# Altium project Tesis.PrjPcb
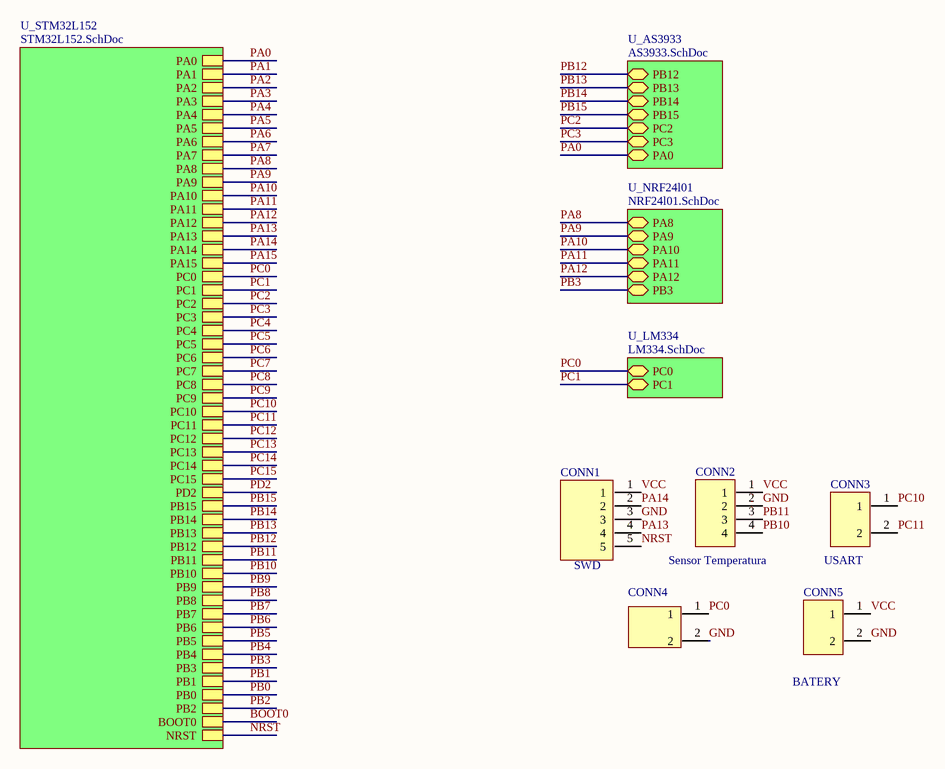
[diagram p0: Top Sheet.SchDoc]
5 sheets, 30 parts. Net scope: global (net labels, ports and power ports of the same name join across sheets).
Board files: PCB_Tesis.PcbDoc, PCB_Tesis2.PcbDoc
Sheets:
  Top Sheet.SchDoc
    U_AS3933 = AS3933.SchDoc
    U_NRF24l01 = NRF24l01.SchDoc
    U_STM32L152 = STM32L152.SchDoc
    U_LM334 = LM334.SchDoc

## Sheet Top Sheet.SchDoc
size A

### Parts
CONN1  SWD  [1x5x2.54 Pin Header TH V]
CONN2  Sensor Temperatura  [1x4x2.54 Pin Header TH V]
CONN3  USART  [1x2x2.54 Pin Header TH V]
CONN4  Connector  [1x2x2.54 Pin Header TH V - duplicate]  (value not drawn)
CONN5  BATERY  [1x2X2.54 Horizontal]

### Sub-sheets
U_AS3933 = AS3933.SchDoc: PA0, PC3, PB15, PB14, PC2, PB13, PB12
U_LM334 = LM334.SchDoc: PC1, PC0
U_NRF24l01 = NRF24l01.SchDoc: PB3, PA8, PA9, PA10, PA11, PA12
U_STM32L152 = STM32L152.SchDoc: PA0, PA1, PA2, PA3, PA4, PA5, PA6, PA7, PA8, PA9, PA10, PA11, PA12, PA13, PA14, PA15, PC0, PC1, PC2, PC3, PC4, PC5, PC6, PC7, PC8, PC9, PC10, PC11, PC12, PC13, PC14, PC15, PD2, PB15, PB14, PB13, PB12, PB11, PB10, PB9, PB8, PB7, PB6, PB5, PB4, PB3, PB1, PB0, PB2, BOOT0, NRST

### Nets
GND: CONN1.3 CONN2.2 CONN4.2 CONN5.2
VCC: CONN1.1 CONN2.1 CONN5.1
NRST: CONN1.5 ; sheet U_STM32L152/NRST
PA0: sheet U_AS3933/PA0, sheet U_STM32L152/PA0
PA8: sheet U_NRF24l01/PA8, sheet U_STM32L152/PA8
PA9: sheet U_NRF24l01/PA9, sheet U_STM32L152/PA9
PA10: sheet U_NRF24l01/PA10, sheet U_STM32L152/PA10
PA11: sheet U_NRF24l01/PA11, sheet U_STM32L152/PA11
PA12: sheet U_NRF24l01/PA12, sheet U_STM32L152/PA12
PA13: CONN1.4 ; sheet U_STM32L152/PA13
PA14: CONN1.2 ; sheet U_STM32L152/PA14
PB3: sheet U_NRF24l01/PB3, sheet U_STM32L152/PB3
PB10: CONN2.4 ; sheet U_STM32L152/PB10
PB11: CONN2.3 ; sheet U_STM32L152/PB11
PB12: sheet U_AS3933/PB12, sheet U_STM32L152/PB12
PB13: sheet U_AS3933/PB13, sheet U_STM32L152/PB13
PB14: sheet U_AS3933/PB14, sheet U_STM32L152/PB14
PB15: sheet U_AS3933/PB15, sheet U_STM32L152/PB15
PC0: CONN4.1 ; sheet U_STM32L152/PC0, sheet U_LM334/PC0
PC1: sheet U_STM32L152/PC1, sheet U_LM334/PC1
PC2: sheet U_AS3933/PC2, sheet U_STM32L152/PC2
PC3: sheet U_AS3933/PC3, sheet U_STM32L152/PC3
PC10: CONN3.1 ; sheet U_STM32L152/PC10
PC11: CONN3.2 ; sheet U_STM32L152/PC11

### Library data of the parts
CONN1 = Header 1x5
CONN2 = Header 1x4
CONN3-CONN5 = Header 1x2

## Sheet AS3933.SchDoc
size A4
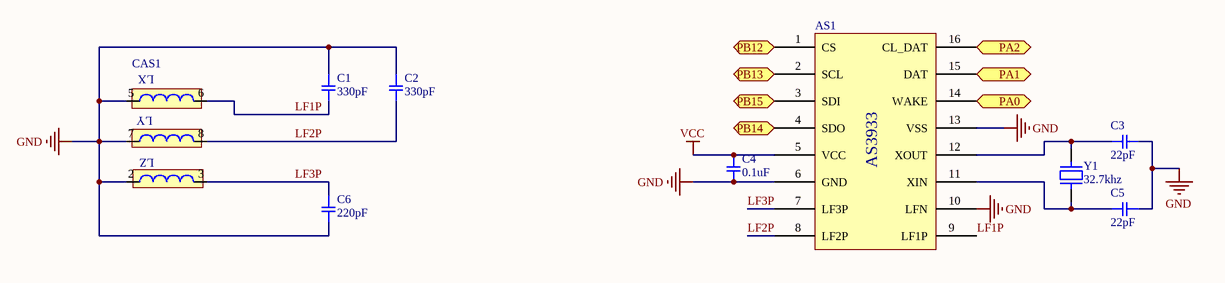
[diagram p1: AS3933.SchDoc]

### Parts
AS1  (no value)  [TSOP65P640X110-16N]
C1  330pF  [SMD-0805C]
C2  330pF  [SMD-0805C]
C3  22pF  [SMD-0805C]
C4  0.1uF  [SMD-0805C]
C5  22pF  [SMD-0805C]
C6  220pF  [SMD-0805C]
CAS1  CAS143-47  [CAS143-47]  (value not drawn)
Y1  32.7khz  [ABRACON ABS07]

### Ports
PA0, PA1, PA2, PB12, PB13, PB14, PB15

### Nets
GND: AS1.6(GND) AS1.10(LFN) AS1.13(VSS) C1.1 C2.1 C3.1 C4.2 C5.1 C6.2 CAS1.2 CAS1.5 CAS1.7
VCC: AS1.5(VCC) C4.1
LF1P: AS1.9(LF1P) C1.2 CAS1.6
LF2P: AS1.8(LF2P) C2.2 CAS1.8
LF3P: AS1.7(LF3P) C6.1 CAS1.3
PA0: AS1.14(WAKE) ; port PA0
PA1: AS1.15(DAT) ; port PA1
PA2: AS1.16(CL_DAT) ; port PA2
PB12: AS1.1(CS) ; port PB12
PB13: AS1.2(SCL) ; port PB13
PB14: AS1.4(SDO) ; port PB14
PB15: AS1.3(SDI) ; port PB15
NetAS1_11: AS1.11(XIN) C5.2 Y1.1
NetAS1_12: AS1.12(XOUT) C3.2 Y1.2

### Notes on the sheet
- (in symbol Component_1) AS3933; LX; LY; LZ

### Library data of the parts
AS1 CAS1 = Component_1
C1 C2 = CC0805GRNPO9BN331: Cap Ceramic 330pF 50V C0G 2%  0805; Manufacturer: Yageo; Part Number: CC0805GRNPO9BN331; Package / Case: 0805; Voltage: 50V; Tolerance: 2%; VALUE: 330pF
C3 C5 = CL21C220JBANNND: Cap Ceramic 22pF 50V C0G 5%0805; Manufacturer: Samsung Electro-Mechanics; Voltage: 100V; Tolerance: 1%; Part Number: CL21C220JBANNND; Package / Case: 0805; VALUE: 22pF
C4 = CL21B104JBCNNNC: CAP CER 0.1uF 50V X7T 0805; Part Number: GC321AD72E103KX01D; Manufacturer: Samsung Electro-Mechanics; Tolerance: 5%; Package / Case: 0805; Voltage: 50V; VALUE: 0.1uF
C6 = GCM2165C2A221FA16D: Cap Ceramic 220pF 100V C0G 1% 0805; Manufacturer: Murata Manufacturing; Part Number: GCM2165C2A221FA16D; Package / Case: 0805; Voltage: 100V; Tolerance: 1%; VALUE: 220pF
Y1 = Abracon Crystal ABS07: SMT Crystal; Value: 32.7khz

## Sheet NRF24l01.SchDoc
size A
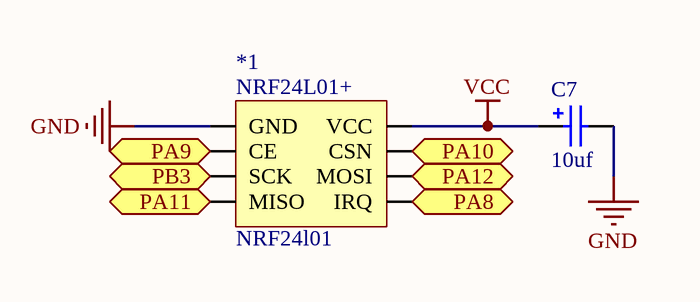
[diagram p2: NRF24l01.SchDoc]

### Parts
*1  NRF24l01  [NRF24l01]
C7  10uf  [SMD-0805C]

### Ports
PA8, PA9, PA10, PA11, PA12, PB3

### Nets
GND: *1.1(GND) C7.2
VCC: *1.2(VCC) C7.1
PA8: *1.8(IRQ) ; port PA8
PA9: *1.3(CE) ; port PA9
PA10: *1.4(CSN) ; port PA10
PA11: *1.7(MISO) ; port PA11
PA12: *1.6(MOSI) ; port PA12
PB3: *1.5(SCK) ; port PB3

### Notes on the sheet
- (in symbol NRF24l01) NRF24L01+

### Library data of the parts
C7 = EKA00AA247F00: Aluminum Electrolytic Capacitor, Radial Style with Long Leads: 47uF, 35V; Note: Refer to Manufacturer's Data Sheets for other lead formations; DrillSize: Nominal, Rounded To The Nearest 0.1mm; Published: 19-Mar-2004; DatasheetDocument: 20-Feb-2001; PackageReference: CAPPR2-5X11; Publisher: Altium Limited; ComponentLink1Description: Manufacturer Link; ComponentLink1URL: http://www.vishay.com/; ComponentLink2Description: Datasheet; ComponentLink2URL: http://www.vishay.com/docs/25014/eka.pdf; Value: 10uF

## Sheet STM32L152.SchDoc
size A4
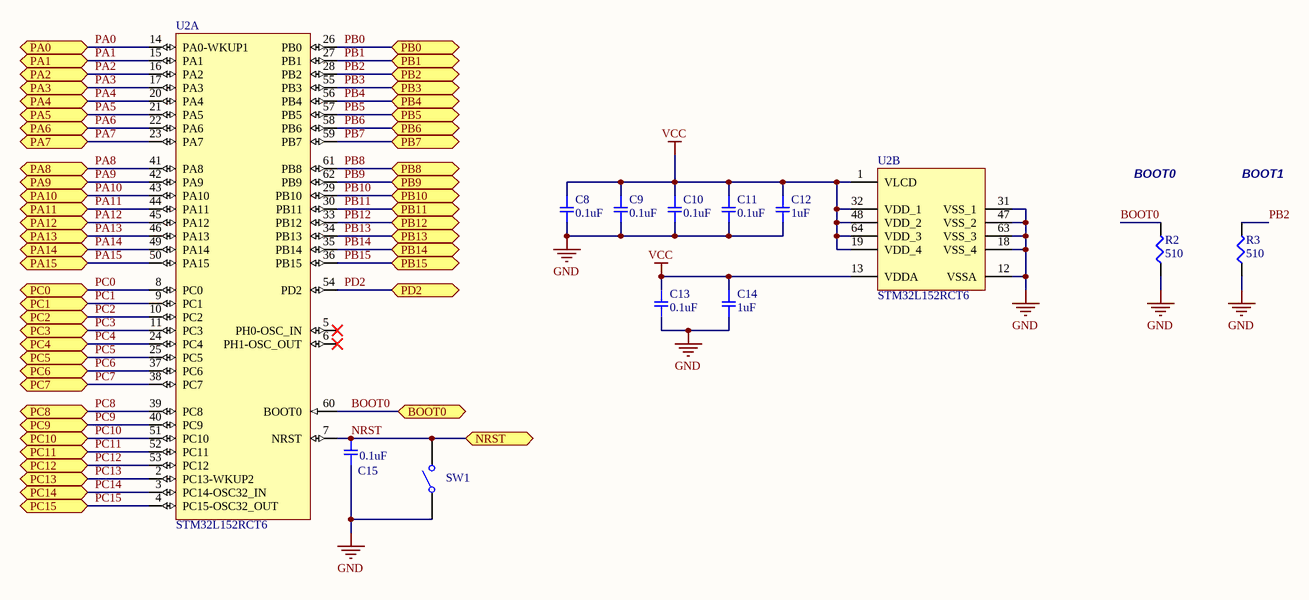
[diagram p3: STM32L152.SchDoc]

### Parts
C8  0.1uF  [SMD-0805C]
C9  0.1uF  [SMD-0805C]
C10  0.1uF  [SMD-0805C]
C11  0.1uF  [SMD-0805C]
C12  1uF  [SMD-0805C]
C13  0.1uF  [SMD-0805C]
C14  1uF  [SMD-0805C]
C15  0.1uF  [SMD-0805C]
R2  510  [SMD-0805-RES]
R3  510  [SMD-0805-RES]
SW1  Switch_Tact  [Switch_Tact]  (value not drawn)
U2  STM32L152RCT6  [STM-LQFP64_L]  (parts A,B of 2)

### Ports
BOOT0, NRST, PA0, PA1, PA2, PA3, PA4, PA5, PA6, PA7, PA8, PA9, PA10, PA11, PA12, PA13, PA14, PA15, PB0, PB1, PB2, PB3, PB4, PB5, PB6, PB7, PB8, PB9, PB10, PB11, PB12, PB13, PB14, PB15, PC0, PC1, PC2, PC3, PC4, PC5, PC6, PC7, PC8, PC9, PC10, PC11, PC12, PC13, PC14, PC15, PD2

### Nets
GND: C8.2 C9.2 C10.2 C11.2 C12.2 C13.2 C14.2 C15.2 R2.1 R3.1 SW1.1 U2.12(VSSA) U2.18(VSS_4) U2.31(VSS_1) U2.47(VSS_2) U2.63(VSS_3)
VCC: C8.1 C9.1 C10.1 C11.1 C12.1 C13.1 C14.1 U2.1(VLCD) U2.13(VDDA) U2.19(VDD_4) U2.32(VDD_1) U2.48(VDD_2) U2.64(VDD_3)
BOOT0: R2.2 U2.60(BOOT0) ; port BOOT0
NRST: C15.1 SW1.2 U2.7(NRST) ; port NRST
PA0: U2.14(PA0-WKUP1) ; port PA0
PA1: U2.15(PA1) ; port PA1
PA2: U2.16(PA2) ; port PA2
PA3: U2.17(PA3) ; port PA3
PA4: U2.20(PA4) ; port PA4
PA5: U2.21(PA5) ; port PA5
PA6: U2.22(PA6) ; port PA6
PA7: U2.23(PA7) ; port PA7
PA8: U2.41(PA8) ; port PA8
PA9: U2.42(PA9) ; port PA9
PA10: U2.43(PA10) ; port PA10
PA11: U2.44(PA11) ; port PA11
PA12: U2.45(PA12) ; port PA12
PA13: U2.46(PA13) ; port PA13
PA14: U2.49(PA14) ; port PA14
PA15: U2.50(PA15) ; port PA15
PB0: U2.26(PB0) ; port PB0
PB1: U2.27(PB1) ; port PB1
PB2: R3.2 U2.28(PB2) ; port PB2
PB3: U2.55(PB3) ; port PB3
PB4: U2.56(PB4) ; port PB4
PB5: U2.57(PB5) ; port PB5
PB6: U2.58(PB6) ; port PB6
PB7: U2.59(PB7) ; port PB7
PB8: U2.61(PB8) ; port PB8
PB9: U2.62(PB9) ; port PB9
PB10: U2.29(PB10) ; port PB10
PB11: U2.30(PB11) ; port PB11
PB12: U2.33(PB12) ; port PB12
PB13: U2.34(PB13) ; port PB13
PB14: U2.35(PB14) ; port PB14
PB15: U2.36(PB15) ; port PB15
PC0: U2.8(PC0) ; port PC0
PC1: U2.9(PC1) ; port PC1
PC2: U2.10(PC2) ; port PC2
PC3: U2.11(PC3) ; port PC3
PC4: U2.24(PC4) ; port PC4
PC5: U2.25(PC5) ; port PC5
PC6: U2.37(PC6) ; port PC6
PC7: U2.38(PC7) ; port PC7
PC8: U2.39(PC8) ; port PC8
PC9: U2.40(PC9) ; port PC9
PC10: U2.51(PC10) ; port PC10
PC11: U2.52(PC11) ; port PC11
PC12: U2.53(PC12) ; port PC12
PC13: U2.2(PC13-WKUP2) ; port PC13
PC14: U2.3(PC14-OSC32_IN) ; port PC14
PC15: U2.4(PC15-OSC32_OUT) ; port PC15
PD2: U2.54(PD2) ; port PD2

Not connected (* = marked no-connect by the designer): U2 5(PH0-OSC_IN)* 6(PH1-OSC_OUT)*

### Notes on the sheet
- BOOT0
- BOOT1

### Library data of the parts
C8-C11 C13 C15 = CL21B104JBCNNNC: as C4 on sheet AS3933; Package / Case: 0805; Voltage: 50V; VALUE: 0.1uF
C12 C14 = CL21B105KOFNNNG: CAP CER 1uF 16V X7T 0805; Manufacturer: Samsung Electro-Mechanics; Tolerance: 10%; Part Number: CL21B105KOFNNNG; Package / Case: 0805; Voltage: 16V; VALUE: 1uF
R2 R3 = ERJ-6GEYJ511V: RES SMD 510 OHM 5% 1/8W 0805; Manufacturer: Panasonic Electronic Components; Factory Stock: 0; Unit Price (USD): 0.00496; @ qty: 1500; Minimum Quantity: 1; Power (Watts): 0.125W, 1/8W; Temperature Coefficient: ±200ppm/°C; Part Number: ERJ-6GEYJ511V; Datasheets: http://industrial.panasonic.com/www-cgi/jvcr13pz.cgi?E+PZ+3+AOA0001+ERJ6GEYJ511V+7+WW; Image: //media.digikey.com/Renders/Panasonic%20Renders/ERJ-0805%20Pkg.jpg; Digi-Key Part Number: P510ACT-ND; Quantity Available: 116915; Packaging: Cut Tape (CT); Series: ERJ; Part Status: Active; Value: 510; Tolerance: ±5%; Composition: Thick Film; Features: Automotive AEC-Q200; Operating Temperature: -55°C ~ 155°C; Package / Case: 0805 (2012 Metric); Supplier Device Package: 0805; Size / Dimension: 0.079" L x 0.049" W (2.00mm x 1.25mm); Height - Seated (Max): 0.028" (0.70mm); Number of Terminations: 2; Failure Rate: -
SW1 = Switch_Tact: WS-TASV SMD Tact Switch 6.0X3.5 mm; PartNumber: 434121050836; NoPins: 04; PackageReference: 434121050836; ComponentLink1Description: Manufacturer URL; ComponentLink1URL: http://www.we-online.com; ComponentLink2Description: Datasheet; ComponentLink2URL: http://katalog.we-online.de/em/datasheet/434121050836.pdf
U2 = STM32L152RCT6: ARM Cortex-M3 32-bit MCU, 256 KB Flash, 32 KB Internal RAM, 51 I/Os, 64-pin LQFP, -40 to 85 degC, Tray; Manufacturer: STMicroelectronics; D/A Converter: 2x12-bit (2 Channel); Data E2PROM nom (B): 8192; Display controller: LCD 4x32/8x28; FLASH Size (Prog) (kB): 256; I/Os (High Current): 51; Internal RAM Size (kB): 32; Supply Voltage(Vcc) min (V): 1.65; DatasheetVersion: Rev. 3; PackageVersion: Rev. 4, 06/2013; PackageReference: LQFP64; PackageDescription: 64-Pin Low Profile Quad Flat Package, 10 x 10 mm Body, 0.5 mm Pitch; Core: ARM Cortex-M3; Operating Frequency(F) (Processor speed) (MHz): 32; Packing: Tray; Mounting Technology: Surface Mount; PartNumber: STM32L152RCT6; ComponentLink1Description: Manufacturer URL; ComponentLink1URL: http://www.st.com/web/en/home.html; ComponentLink2Description: Datasheet; ComponentLink2URL: http://www.st.com/st-web-ui/static/active/en/resource/technical/document/datasheet/DM00048356.pdf; ComponentLink3Description: Package Specification; ComponentLink3URL: http://www.st.com/st-web-ui/static/active/en/resource/technical/document/datasheet/DM00037051.pdf

## Sheet LM334.SchDoc
size A
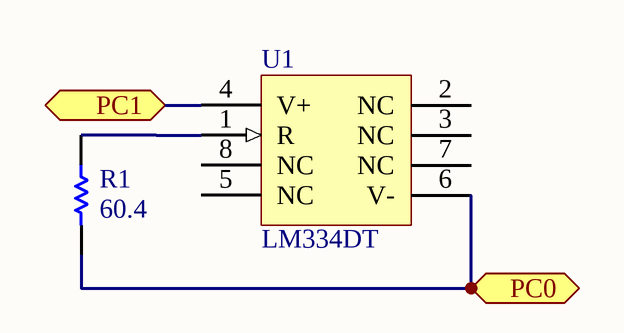
[diagram p4: LM334.SchDoc]

### Parts
R1  value 60.4  [SMD-0805-RES]  (hidden comment: Res1)
U1  LM334DT  [M08A_M]

### Ports
PC0, PC1

### Nets
PC0: R1.2 U1.6(V-) ; port PC0
PC1: U1.4(V+) ; port PC1
NetR1_1: R1.1 U1.1(R)

Not connected (* = marked no-connect by the designer): U1 2(NC) 3(NC) 5(NC) 7(NC) 8(NC)

### Library data of the parts
R1 = Res1: Resistor; Published: 8-Jun-2000; LatestRevisionDate: 17-Jul-2002; LatestRevisionNote: Re-released for DXP Platform.; PackageReference: AXIAL-0.3; Publisher: Altium Limited; PackageDescription: Axial Device, Thru-Hole; 2 Leads; 0.3 in Pin Spacing
U1 = LM334DT: 3-Terminal Adjustable Current Source, 8-pin Narrow SOIC; PartNumber: LM334M; Manufacturer: National Semiconductor; PackageTopMarking: NSZXTT*LM334*M; PowerWise: N; CompType: MiscPower; High-Reliability: Y; DatasheetVersion: Mar-2005; PackageVersion: revM, May-2009; PackageReference: M08A; PackageDescription: SOIC Narrow, 4.9 x 3.9 x 1.45mm, 8 Lead, 1.27mm Pitch; RoHS: N; PinCount: 8; Code_JEDEC: MS-012-AA; Code_IPC: SOIC127P600-8; ComponentLink1Description: Manufacturer URL; ComponentLink1URL: http://www.national.com/; ComponentLink2Description: LM334 Datasheet; ComponentLink2URL: http://www.national.com/ds/LM/LM334.pdf; ComponentLink3Description: LM334 Web Page; ComponentLink3URL: http://www.national.com/pf/LM/LM334.html; ComponentLink4Description: M08A Package Page; ComponentLink4URL: http://www.national.com/packaging/folders/m08a.html

## Nets that join several sheets
GND: Top Sheet (CONN1.3 CONN2.2 CONN4.2 CONN5.2), AS3933 (12 pins), NRF24l01 (*1.1 C7.2), STM32L152 (16 pins)
VCC: Top Sheet (CONN1.1 CONN2.1 CONN5.1), AS3933 (AS1.5 C4.1), NRF24l01 (*1.2 C7.1), STM32L152 (13 pins)
NRST: Top Sheet (CONN1.5), STM32L152 (C15.1 SW1.2 U2.7)
PA0: AS3933 (AS1.14), STM32L152 (U2.14)
PA1: AS3933 (AS1.15), STM32L152 (U2.15)
PA2: AS3933 (AS1.16), STM32L152 (U2.16)
PA8: NRF24l01 (*1.8), STM32L152 (U2.41)
PA9: NRF24l01 (*1.3), STM32L152 (U2.42)
PA10: NRF24l01 (*1.4), STM32L152 (U2.43)
PA11: NRF24l01 (*1.7), STM32L152 (U2.44)
PA12: NRF24l01 (*1.6), STM32L152 (U2.45)
PA13: Top Sheet (CONN1.4), STM32L152 (U2.46)
PA14: Top Sheet (CONN1.2), STM32L152 (U2.49)
PB3: NRF24l01 (*1.5), STM32L152 (U2.55)
PB10: Top Sheet (CONN2.4), STM32L152 (U2.29)
PB11: Top Sheet (CONN2.3), STM32L152 (U2.30)
PB12: AS3933 (AS1.1), STM32L152 (U2.33)
PB13: AS3933 (AS1.2), STM32L152 (U2.34)
PB14: AS3933 (AS1.4), STM32L152 (U2.35)
PB15: AS3933 (AS1.3), STM32L152 (U2.36)
PC0: Top Sheet (CONN4.1), STM32L152 (U2.8), LM334 (R1.2 U1.6)
PC1: STM32L152 (U2.9), LM334 (U1.4)
PC10: Top Sheet (CONN3.1), STM32L152 (U2.51)
PC11: Top Sheet (CONN3.2), STM32L152 (U2.52)